# EAGLE design Accessory - ADC v2 (EAGLE 5.06)
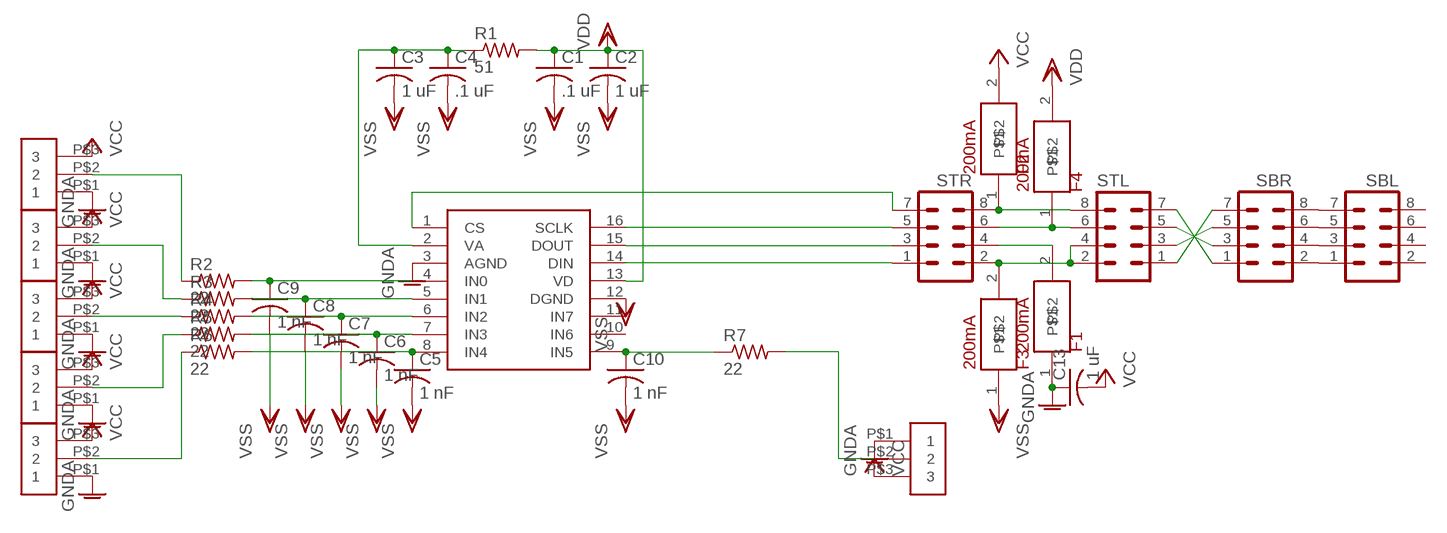
[diagram p0: schematic, sheet 1]

## Parts
C1  .1 uF  C-USC0603  [C0603]
C2  1 uF  C-USC0603  [C0603]
C3  1 uF  C-USC0603  [C0603]
C4  .1 uF  C-USC0603  [C0603]
C5  1 nF  C-USC0201  [C0201]
C6  1 nF  C-USC0201  [C0201]
C7  1 nF  C-USC0201  [C0201]
C8  1 nF  C-USC0201  [C0201]
C9  1 nF  C-USC0201  [C0201]
C10  1 nF  C-USC0201  [C0201]
C13  1 uF  C-USC0603  [C0603]
F1  200mA  FUSE  [R0603]
F2  200mA  FUSE  [R0603]
F3  200mA  FUSE  [R0603]
F4  200mA  FUSE  [R0603]
R1  51  R-US_R0603  [R0603]
R2  22  R-US_R0201  [R0201]
R3  22  R-US_R0201  [R0201]
R4  22  R-US_R0201  [R0201]
R5  22  R-US_R0201  [R0201]
R6  22  R-US_R0201  [R0201]
R7  22  R-US_R0201  [R0201]
SBL  MA04-2  [MA04-2]
SBR  MA04-2  [MA04-2]
STL  MA04-2  [MA04-2]
STR  MA04-2  [MA04-2]
U$1  ADC128S102  ADC128S102TSSOP16  [TSSOP16]
U$4  292207-3  [292207-3]
U$5  292207-3  [292207-3]
U$6  292207-3  [292207-3]
U$7  292207-3  [292207-3]
U$8  292207-3  [292207-3]
U$9  292207-3  [292207-3]

## Nets
GNDA: C13.1 F1.1 U$1.3(AGND) U$4.P$1 U$5.P$1 U$6.P$1 U$7.P$1 U$8.P$1 U$9.P$1
N$1: C5.1 R6.2 U$1.8(IN4)
N$2: C10.1 R7.1 U$1.9(IN5)
N$3: C6.1 R5.2 U$1.7(IN3)
N$4: C7.1 R4.2 U$1.6(IN2)
N$5: C8.1 R3.2 U$1.5(IN1)
N$6: C9.1 R2.2 U$1.4(IN0)
N$7: SBR.7 STL.1
N$8: SBR.1 STL.7
N$9: SBR.3 STL.5
N$10: SBR.5 STL.3
N$14: SBL.1 SBR.2
N$15: SBL.3 SBR.4
N$16: SBL.5 SBR.6
N$17: SBL.7 SBR.8
N$18: STR.7 U$1.1(CS)
N$19: STR.5 U$1.16(SCLK)
N$20: F4.1 STL.6 STR.6
N$21: F3.2 STL.2 STL.4 STR.2
N$22: STR.3 U$1.15(DOUT)
N$23: STR.1 U$1.14(DIN)
N$24: F1.2 STR.4
N$25: R2.1 U$9.P$2
N$26: R3.1 U$5.P$2
N$27: R4.1 U$6.P$2
N$28: R5.1 U$7.P$2
N$29: R6.1 U$8.P$2
N$32: R7.2 U$4.P$2
N$33: F2.1 STL.8 STR.8
N$34: C3.1 C4.1 R1.1 U$1.2(VA)
VCC: C13.2 F2.2 U$4.P$3 U$5.P$3 U$6.P$3 U$7.P$3 U$8.P$3 U$9.P$3
VDD: C1.1 C2.1 F4.2 R1.2 U$1.13(VD)
VSS: C1.2 C2.2 C3.2 C4.2 C5.2 C6.2 C7.2 C8.2 C9.2 C10.2 F3.1 U$1.12(DGND)
Unconnected: SBL.2 SBL.4 SBL.6 SBL.8 U$1.10(IN6) U$1.11(IN7)

## Library data of the parts
C1-C10 C13 = rcl:C-US: CAPACITOR, American symbol
F1-F4 = rcl:FUSE
R1-R7 = rcl:R-US_: RESISTOR, American symbol
SBL SBR STL STR = con-lstb:MA04-2: PIN HEADER
U$1 = ref-packages:ADC128S102
U$4-U$9 = con-tyco:292207-3

## Board
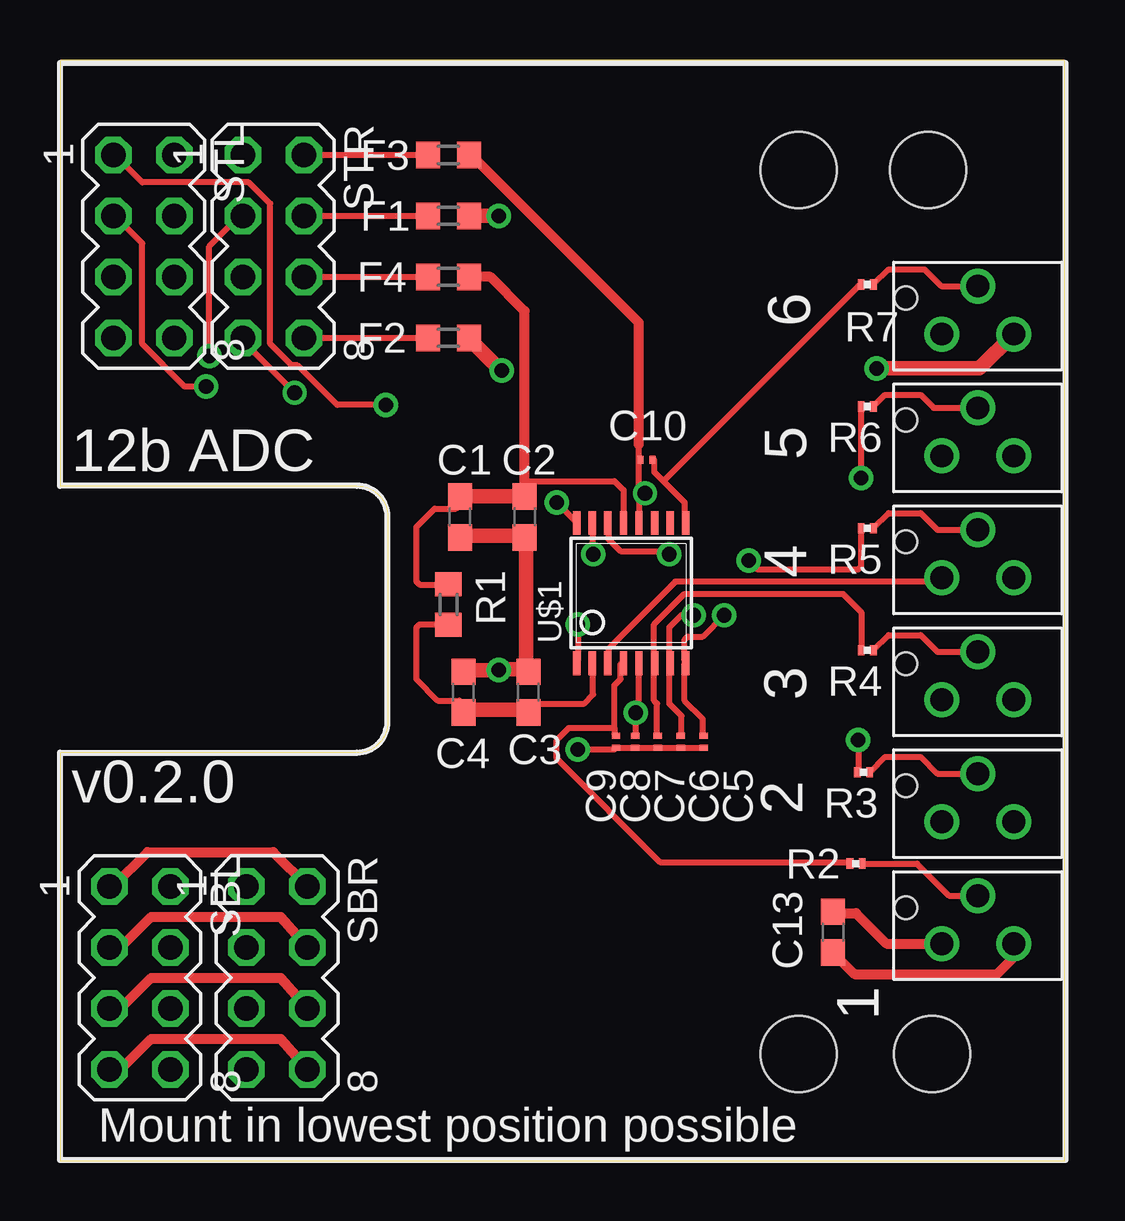
[diagram p1: board, top side]
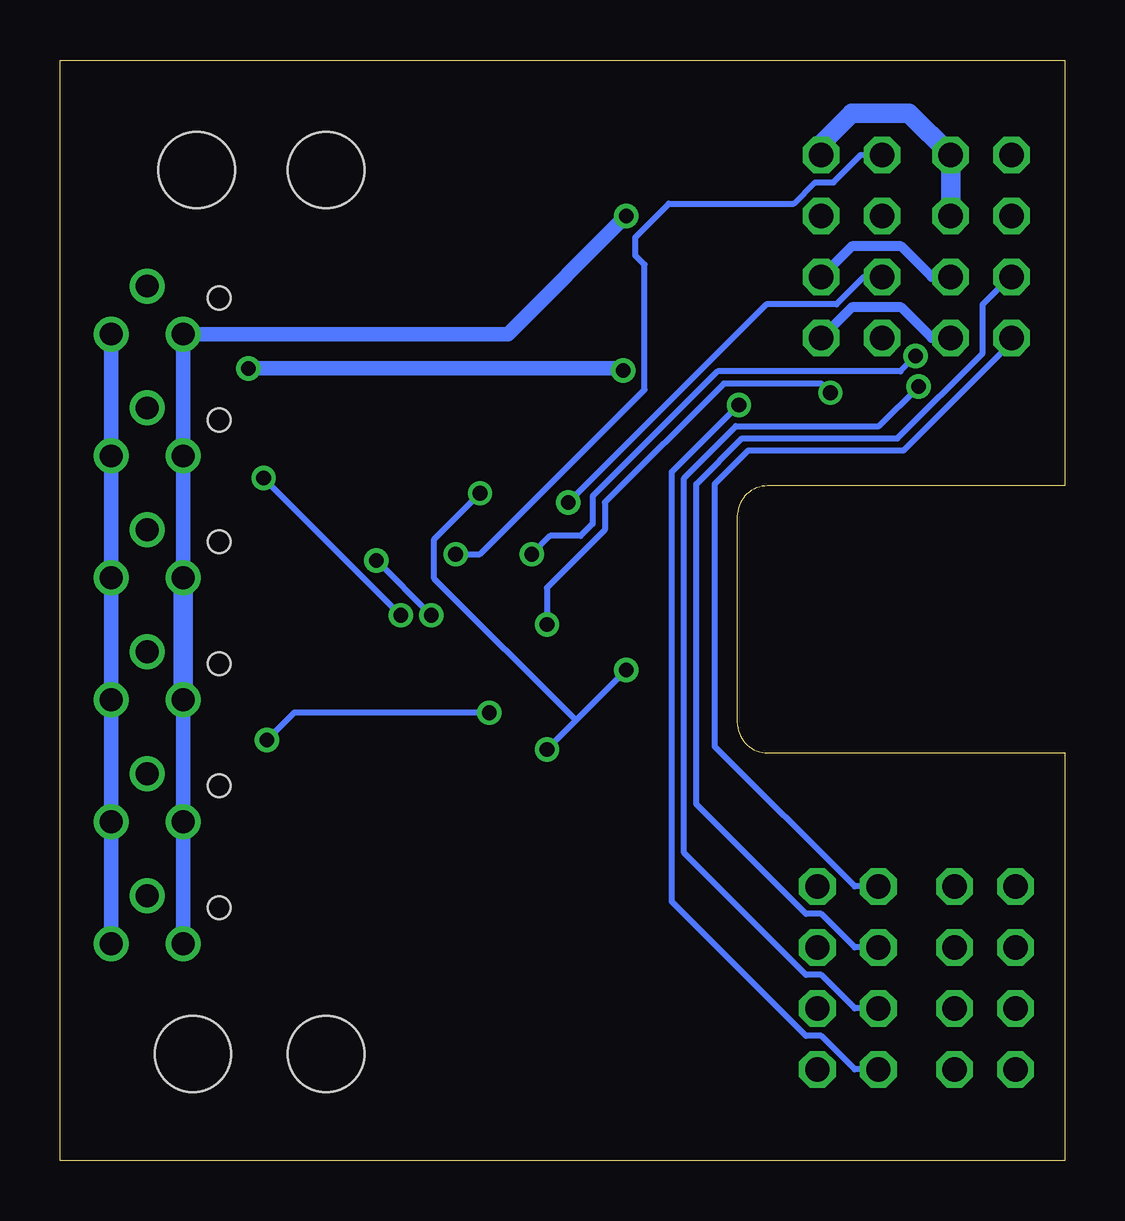
[diagram p2: board, bottom side, seen from below]

Size 41.89 x 45.87 mm. Coordinates in mm from the lower left corner, seen from the top.
Outline: 0,0 41.89,0 41.89,45.87 0,45.87 0,28.12 12.39,28.12 arc-90 13.66,26.85 13.66,18.27 arc-90 12.39,17 0,17 0,0
Copper layers (1*16): Top 0.035mm / dielectric 1.5mm / Bottom 0.035mm
Design rules "default": minimum track width 10mil, minimum drill 24mil, track to track 8mil, track to pad 8mil, pad to pad 8mil, via to via 8mil, smd to smd 8mil, copper to edge 40mil, drill to drill 8mil, minimum pad ring 10mil, minimum via ring 8mil, stop-mask expansion 4mil, vias tented up to drill 0mil, thermal gap 10mil
Holes 3.17 mm at 30.8,41.27 36.2,41.27 30.8,4.45 36.35,4.45

### Footprints (pad centres in the part's own frame; a part is rotated, then mirrored left to right if it is on the bottom)
C0603 = smd 1.1 x 1: 1 -0.85,0; 2 0.85,0
C0201 = smd 0.25 x 0.35: 1 -0.25,0; 2 0.25,0
R0603 = smd 1 x 1.1: 1 -0.85,0; 2 0.85,0
R0201 = smd 0.28 x 0.43: 1 -0.255,0; 2 0.255,0
MA04-2 = drill 1.016 octagon: 1 -3.81,-1.27; 2 -3.81,1.27; 3 -1.27,-1.27; 4 -1.27,1.27; 5 1.27,-1.27; 6 1.27,1.27; 7 3.81,-1.27; 8 3.81,1.27
TSSOP16 = smd 0.305 x 0.991: 1 -2.275,-2.918; 2 -1.625,-2.918; 3 -0.975,-2.918; 4 -0.325,-2.918; 5 0.325,-2.918; 6 0.975,-2.918; 7 1.625,-2.918; 8 2.275,-2.918; 9 2.275,2.918; 10 1.625,2.918; 11 0.975,2.918; 12 0.325,2.918; 13 -0.325,2.918; 14 -0.975,2.918; 15 -1.625,2.918; 16 -2.275,2.918
292207-3 = drill 0.95 round: P$1 -1.5,0; P$2 0,2; P$3 1.5,0 | hole 0.95: -3,1.5

### Placement (x,y rotation side)
C1  16.67,26.83 270 top
C2  19.37,26.83 270 top
C3  19.53,19.53 90 top
C4  16.83,19.53 90 top
C5  26.83,17.46 270 top
C6  25.88,17.46 270 top
C7  24.92,17.46 270 top
C8  23.97,17.46 270 top
C9  23.18,17.46 270 top
C10  24.45,29.21 180 top
C13  32.23,9.53 270 top
F1  16.19,39.37 180 top
F2  16.19,34.29 0 top
F3  16.19,41.91 180 top
F4  16.19,36.83 0 top
R1  16.19,23.18 90 top
R2  33.18,12.38 180 top
R3  33.5,16.19 180 top
R4  33.66,21.27 180 top
R5  33.66,26.35 180 top
R6  33.66,31.43 180 top
R7  33.66,36.51 0 top
SBL  3.33,7.62 270 top
SBR  9.05,7.62 270 top
STL  3.49,38.1 270 top
STR  8.89,38.1 270 top
U$1  23.81,23.65 0 top
U$4  38.26,34.45 0 top
U$5  38.26,14.13 0 top
U$6  38.26,19.21 0 top
U$7  38.26,24.29 0 top
U$8  38.26,29.37 0 top
U$9  38.26,9.05 0 top

### Tracks (layer width: path | path; a pad name or v marks a point on that pad's centre or on a via)
GNDA  (via drill 0.61)
  Top 0.254: U$1.3 22.86,20.83 22.86,21.34 25.65,24.13 36.58,24.13 36.7,24.26 U$7.P$1 | 17.14,39.37 F1.1
  Top 0.406: U$9.P$1 34.45,9.05 33.18,10.32 32.28,10.32 C13.1
  Top 0.61: v18.29,39.37 17.14,39.37
  Bottom 0.254: U$4.P$1 36.58,34.29
  Bottom 0.61: U$7.P$1 U$8.P$1 U$4.P$1 23.21,34.45 v18.29,39.37 | U$6.P$1 | U$5.P$1 U$6.P$1 | U$5.P$1 | U$9.P$1 U$5.P$1
  Bottom 0.813: U$6.P$1 U$7.P$1 | U$6.P$1
N$1  (via drill 0.61)
  Top 0.254: C5.1 26.8,17.78 26.8,18.41 26.04,19.18 26.04,20.7 U$1.8 26.04,20.83 26.04,21.72 26.16,21.84 26.8,21.84 v27.69,22.73 | v33.4,28.45 33.4,31.37 R6.2
  Bottom 0.254: v27.69,22.73 v33.4,28.45
N$2
  Top 0.254: 25.15,28.32 26.04,27.43 26.04,26.67 U$1.9 | 25.15,28.32 24.77,28.7 24.77,29.21 C10.1 | 25.15,28.32 33.27,36.45 R7.1
N$3  (via drill 0.61)
  Top 0.254: C6.1 25.91,17.78 25.91,18.54 25.4,19.05 25.4,20.7 U$1.7 25.4,20.83 25.4,22.23 25.91,22.73 v26.42,22.73 | v28.7,25.02 29.08,24.64 33.27,24.64 33.4,24.77 33.4,26.29 R5.2
  Bottom 0.254: v26.42,22.73 v28.7,25.02
N$4
  Top 0.254: C7.1 24.89,17.78 24.89,19.05 24.77,19.18 24.77,20.7 U$1.6 24.77,20.83 24.77,22.35 26.04,23.62 32.64,23.62 33.4,22.86 33.4,21.34 R4.2
N$5  (via drill 0.61)
  Top 0.254: C8.1 24,17.78 v24,18.67 24,19.05 24.13,19.18 24.13,20.7 U$1.5 | v33.27,17.53 33.27,16.26 R3.2
  Bottom 0.254: v33.27,17.53 32.13,18.67 v24,18.67
N$6
  Top 0.254: 23.11,18.03 23.11,19.81 23.37,20.07 23.37,20.7 U$1.4 | 23.11,18.03 23.11,17.78 C9.1 | 23.11,18.03 21.21,18.03 20.7,17.53 20.7,16.76 25.02,12.45 32.89,12.45 R2.2
N$7  (via drill 0.61)
  Top 0.254: v13.59,31.5 11.56,31.5 9.91,33.15 9.65,33.15 8.76,34.04 8.76,39.88 7.87,40.77 3.43,40.77 2.29,41.91 STL.1
  Bottom 0.254: v13.59,31.5 16.38,28.7 16.38,10.79 10.79,5.21 10.16,5.21 8.76,3.81 SBR.7
N$8
  Bottom 0.254: SBR.1 8.76,11.43 14.61,17.27 14.61,28.19 13.21,29.59 6.73,29.59 2.29,34.04 2.29,34.29 STL.7
N$9
  Bottom 0.254: SBR.3 8.76,8.89 10.16,10.29 10.79,10.29 15.37,14.86 15.37,28.19 13.46,30.1 6.99,30.1 3.43,33.66 3.43,35.69 2.29,36.83 STL.5
N$10  (via drill 0.61)
  Top 0.254: v6.1,32.26 5.21,32.26 3.43,34.04 3.43,38.23 2.29,39.37 STL.3
  Bottom 0.254: v6.1,32.26 7.75,30.61 13.72,30.61 15.88,28.45 15.88,12.83 10.79,7.75 10.16,7.75 8.76,6.35 SBR.5
N$14
  Top 0.406: SBL.1 2.22,11.43 3.65,12.86 8.89,12.86 SBR.2
N$15
  Top 0.406: SBL.3 2.54,8.89 3.81,10.16 9.21,10.16 SBR.4
N$16
  Top 0.406: SBL.5 2.54,6.35 3.81,7.62 9.21,7.62 SBR.6
N$17
  Top 0.406: SBL.7 2.54,3.81 3.81,5.08 9.21,5.08 SBR.8
N$18  (via drill 0.61)
  Top 0.254: v21.59,22.35 21.59,20.83 U$1.1 | v9.78,32 7.75,34.04 7.75,34.29 STR.7
  Bottom 0.254: v21.59,22.35 21.59,23.88 19.18,26.29 19.18,27.43 14.22,32.38 10.16,32.38 v9.78,32
N$19  (via drill 0.61)
  Top 0.254: v20.7,27.43 21.46,26.67 U$1.16
  Bottom 0.254: v20.7,27.43 12.45,35.69 9.53,35.69 8.38,36.83 7.75,36.83 STR.5
N$20
  Top 0.254: F4.1 10.29,36.83 STR.6
  Bottom 0.406: STL.6 5.56,36.83 6.83,38.1 8.89,38.1 STR.6
N$21
  Top 0.254: F3.2 10.29,41.91 STR.2
  Bottom 0.254: STL.2 4.83,42.04 | 10.16,42.04 STR.2
  Bottom 0.406: 10.16,42.07 10.16,42.04
  Bottom 0.813: STL.4 STL.2 6.51,43.66 8.89,43.66 10.16,42.39 10.16,42.07
N$22  (via drill 0.61)
  Top 0.254: v22.23,25.27 22.23,26.54 U$1.15 | v6.22,33.53 6.22,38.1 7.62,39.5 STR.3
  Bottom 0.254: v22.23,25.27 21.46,26.04 20.19,26.04 19.68,26.54 19.68,27.69 14.48,32.89 6.86,32.89 v6.22,33.53
N$23  (via drill 0.61)
  Top 0.254: v25.4,25.27 25.27,25.4 23.37,25.4 22.86,25.91 22.86,26.54 U$1.14
  Bottom 0.254: v25.4,25.27 24.38,25.27 17.53,32.13 17.53,37.34 17.91,37.72 17.91,38.48 16.51,39.88 11.3,39.88 10.41,40.77 9.65,40.77 8.51,41.91 7.75,41.91 STR.1
N$24
  Top 0.254: F1.2 15.24,39.37 10.29,39.37 STR.4
N$25
  Top 0.254: U$9.P$2 37.05,11.05 35.72,12.38 R2.1 | R2.1
N$26
  Top 0.254: U$5.P$2 36.58,16.13 35.88,16.83 34.39,16.83 R3.1
N$27
  Top 0.254: U$6.P$2 36.58,21.21 35.88,21.91 34.55,21.91 R4.1
N$28
  Top 0.254: U$7.P$2 36.58,26.29 35.88,26.99 34.55,26.99 R5.1
N$29
  Top 0.254: U$8.P$2 36.42,31.37 35.88,31.91 34.39,31.91 R6.1
N$32
  Top 0.254: U$4.P$2 36.73,36.45 36.04,37.15 34.55,37.15 R7.2
N$33
  Top 0.254: F2.1 10.29,34.29 STR.8
  Bottom 0.406: STL.8 5.56,34.29 6.83,35.56 8.89,35.56 STR.8
N$34
  Top 0.254: U$1.2 22.23,20.7 22.23,19.43 21.84,19.05 19.68,19.05 19.43,18.8 C3.1 | R1.1 16.13,22.35 14.99,22.35 14.86,22.23 14.86,20.07 15.75,19.18 16.64,19.18 16.76,19.05 16.76,18.8 C4.1
  Top 0.61: 19.43,18.8 16.83,18.8 C4.1
VCC  (via drill 0.61)
  Top 0.254: 17.02,34.29 F2.2
  Top 0.406: U$9.P$3 39.76,8.48 39.05,7.78 33.12,7.78 C13.2
  Top 0.61: 17.02,34.29 18.38,32.92 v18.41,32.92 | v34.04,33.02 38.33,33.02 U$4.P$3
  Bottom 0.61: U$5.P$3 | U$9.P$3 U$5.P$3 | U$5.P$3 | U$5.P$3 U$6.P$3 | U$6.P$3 | U$6.P$3 U$7.P$3 U$8.P$3 U$4.P$3 | v18.41,32.92 18.51,33.02 v34.04,33.02
VDD
  Top 0.254: R1.2 16.13,24 14.99,24 14.86,24.13 14.86,26.42 15.62,27.18 16.51,27.18 16.64,27.3 16.64,27.56 C1.1 16.64,27.69 | U$1.13 23.5,26.67 23.5,27.94 23.11,28.32 19.43,28.32 19.43,27.69 C2.1 | F4.2 17.02,36.83
  Top 0.406: F4.2 17.94,36.83 19.37,35.4 C2.1
  Top 0.61: 16.64,27.69 C2.1
VSS  (via drill 0.61)
  Top 0.254: 16.64,25.91 C1.2 16.76,26.04 | C6.2 C7.2 C8.2 C9.2 23.11,17.14 v21.59,17.14 | C6.2 C5.2 | C6.2 | 19.3,26.04 C2.2 19.43,25.91 | C4.2 16.89,20.45 | 19.43,20.45 C3.2 19.43,20.57 | 24.13,27.81 24.13,26.67 U$1.12 | 24.13,27.81 24.13,29.21 | 24.13,29.21 24.13,29.84 24.13,33.91 | 17.14,41.91 F3.1 | 24.13,29.21 C10.2 | v24.38,27.81 24.13,27.81
  Top 0.406: 17.14,41.91 24.13,34.92 24.13,29.84
  Top 0.61: 19.43,20.47 19.43,25.91 | 19.43,20.47 C3.2 | 16.76,26.04 19.31,26.04 C2.2 | 19.43,20.47 18.31,20.47 v18.29,20.45 16.89,20.45
  Bottom 0.254: v18.29,20.45 20.38,18.35 | 20.38,18.35 v21.59,17.14 | v24.38,27.81 26.29,25.91 26.29,24.26 20.38,18.35

### Text on the board
tNames: 6 | 12b ADC | 5 | 4 | 3 | v0.2.0 | 2 | 1 | Mount in lowest position possible